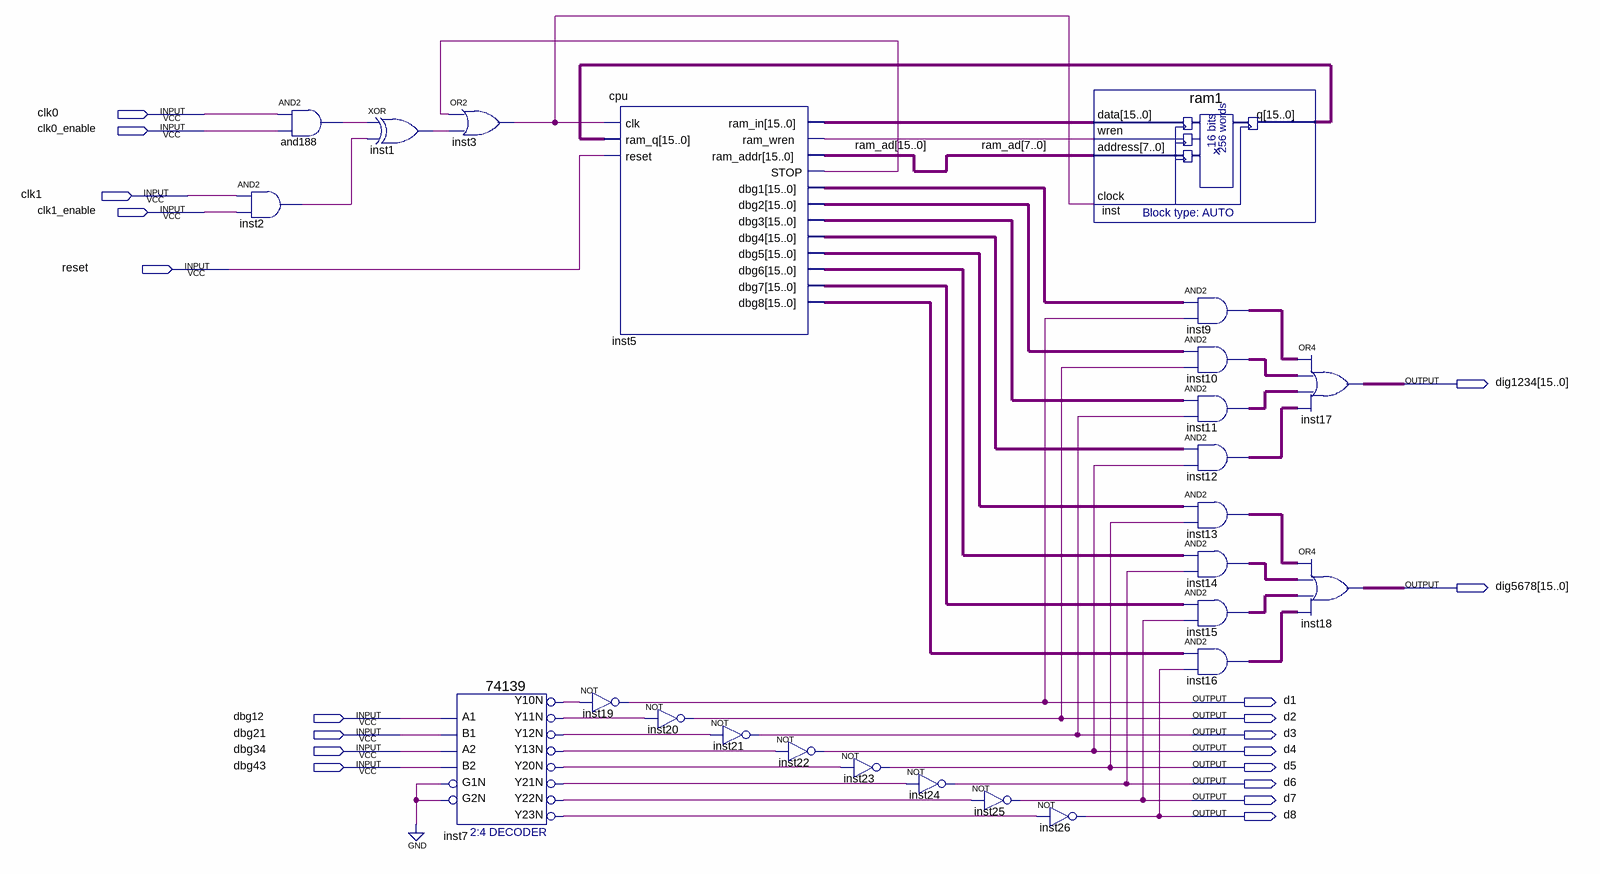
[diagram p0: schematic sheet]
// Quartus schematic soc.bdf as structural Verilog: 25 symbols, 19 pins
module soc (
  input  clk0,
  input  clk0_enable,
  input  clk1,
  input  clk1_enable,
  input  reset,
  input  dbg12,
  input  dbg21,
  input  dbg34,
  input  dbg43,
  output [15:0] dig1234,
  output [15:0] dig5678,
  output d1,
  output d2,
  output d3,
  output d4,
  output d5,
  output d6,
  output d7,
  output d8
);

  wire and188_out, inst1_out, inst2_out, inst3_out, inst5_ram_wren, inst5_stop, inst7_y10n, inst7_y11n,
       inst7_y12n, inst7_y13n, inst7_y20n, inst7_y21n, inst7_y22n, inst7_y23n;
  wire [15:0] inst5_dbg1, inst5_dbg2, inst5_dbg3, inst5_dbg4, inst5_dbg5, inst5_dbg6, inst5_dbg7, inst5_dbg8,
       inst5_ram_in, inst9_out, inst10_out, inst11_out, inst12_out, inst13_out, inst14_out, inst15_out,
       inst16_out, inst_q, ram_ad;

  and inst2 (inst2_out, clk1, clk1_enable);
  and and188 (and188_out, clk0, clk0_enable);
  xor inst1 (inst1_out, and188_out, inst2_out);
  or inst3 (inst3_out, inst5_stop, inst1_out);
  \74139  inst7 (
    .A1(dbg12), .A2(dbg34), .B1(dbg21), .B2(dbg43), .G1N(1'b0), .G2N(1'b0), .Y10N(inst7_y10n),
    .Y20N(inst7_y20n), .Y13N(inst7_y13n), .Y12N(inst7_y12n), .Y11N(inst7_y11n), .Y21N(inst7_y21n),
    .Y22N(inst7_y22n), .Y23N(inst7_y23n));
  cpu inst5 (
    .clk(inst3_out), .ram_q(inst_q), .reset(reset), .ram_in(inst5_ram_in), .ram_wren(inst5_ram_wren),
    .ram_addr(ram_ad), .STOP(inst5_stop), .dbg1(inst5_dbg1), .dbg2(inst5_dbg2), .dbg3(inst5_dbg3),
    .dbg4(inst5_dbg4), .dbg5(inst5_dbg5), .dbg6(inst5_dbg6), .dbg7(inst5_dbg7), .dbg8(inst5_dbg8));
  not inst19 (d1, inst7_y10n);
  not inst20 (d2, inst7_y11n);
  not inst21 (d3, inst7_y12n);
  not inst22 (d4, inst7_y13n);
  not inst23 (d5, inst7_y20n);
  not inst24 (d6, inst7_y21n);
  not inst25 (d7, inst7_y22n);
  not inst26 (d8, inst7_y23n);
  ram1 inst (.data(inst5_ram_in), .wren(inst5_ram_wren), .address(ram_ad[7:0]), .clock(inst3_out), .q(inst_q));
  assign inst9_out = inst5_dbg1 & {16{d1}};  // AND2 inst9, 16 bits wide
  assign inst10_out = inst5_dbg2 & {16{d2}};  // AND2 inst10, 16 bits wide
  assign inst11_out = inst5_dbg3 & {16{d3}};  // AND2 inst11, 16 bits wide
  assign inst12_out = inst5_dbg4 & {16{d4}};  // AND2 inst12, 16 bits wide
  assign inst13_out = inst5_dbg5 & {16{d5}};  // AND2 inst13, 16 bits wide
  assign inst14_out = inst5_dbg6 & {16{d6}};  // AND2 inst14, 16 bits wide
  assign inst15_out = inst5_dbg7 & {16{d7}};  // AND2 inst15, 16 bits wide
  assign inst16_out = inst5_dbg8 & {16{d8}};  // AND2 inst16, 16 bits wide
  assign dig1234 = inst9_out | inst10_out | inst11_out | inst12_out;  // OR4 inst17, 16 bits wide
  assign dig5678 = inst13_out | inst14_out | inst15_out | inst16_out;  // OR4 inst18, 16 bits wide
endmodule
